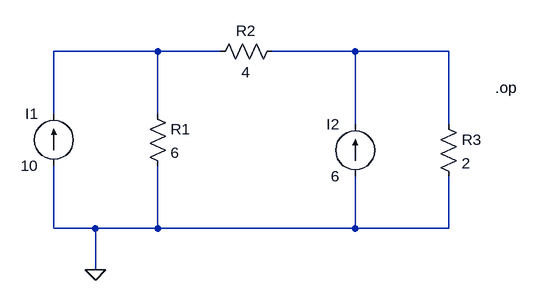
[diagram p0: schematic Draft4.asc]
Draft4.asc, the LTspice schematic file:
Version 4
SHEET 1 880 680
WIRE 192 240 32 240
WIRE 288 240 192 240
WIRE 496 240 368 240
WIRE 640 240 496 240
WIRE 32 336 32 240
WIRE 192 336 192 240
WIRE 496 352 496 240
WIRE 640 352 640 240
WIRE 32 512 32 416
WIRE 96 512 32 512
WIRE 192 512 192 416
WIRE 192 512 96 512
WIRE 496 512 496 432
WIRE 496 512 192 512
WIRE 640 512 640 432
WIRE 640 512 496 512
WIRE 96 576 96 512
FLAG 96 576 0
SYMBOL current 32 416 R180
WINDOW 0 24 80 Left 2
WINDOW 3 24 0 Left 2
SYMATTR InstName I1
SYMATTR Value 10
SYMBOL res 176 320 R0
SYMATTR InstName R1
SYMATTR Value 6
SYMBOL res 384 224 R90
WINDOW 0 0 56 VBottom 2
WINDOW 3 32 56 VTop 2
SYMATTR InstName R2
SYMATTR Value 4
SYMBOL current 496 432 R180
WINDOW 0 24 80 Left 2
WINDOW 3 24 0 Left 2
SYMATTR InstName I2
SYMATTR Value 6
SYMBOL res 624 336 R0
SYMATTR InstName R3
SYMATTR Value 2
TEXT 712 296 Left 2 !.op

The netlist it stands for:
* Draft4.asc
I1 0 N001 10
R1 N001 0 6
R2 N002 N001 4
I2 0 N002 6
R3 N002 0 2
.op
.backanno
.end